# EAGLE design TQFP32ProgrammerShield (EAGLE 8.2.1)
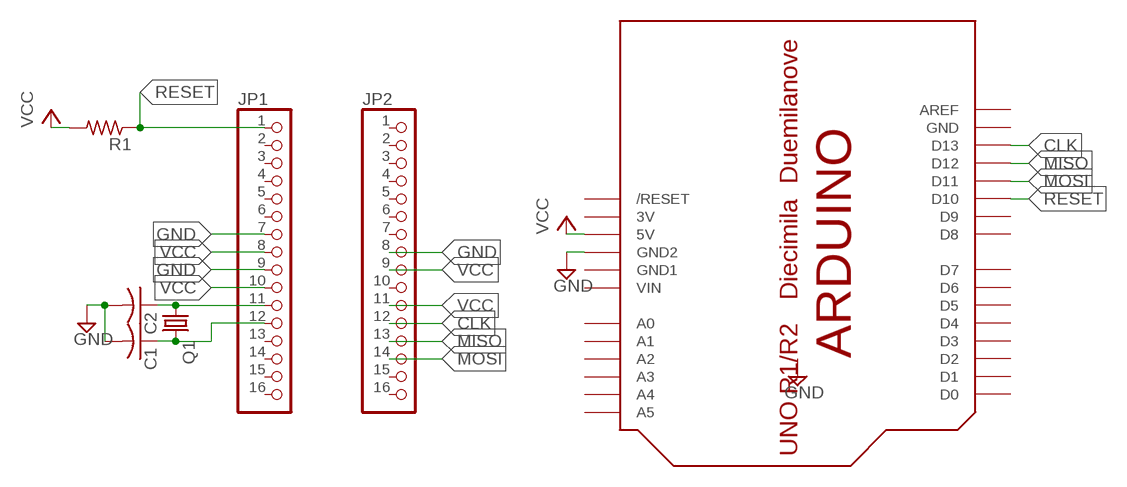
[diagram p0: schematic, sheet 1]

## Parts
C1  C-US025-030X050  [C025-030X050]
C2  C-US025-030X050  [C025-030X050]
JP1  PINHD-1X16  [1X16]
JP2  PINHD-1X16  [1X16]
Q1  CRYSTALHC49S  [HC49/S]
R1  R-US_0204/7  [0204/7]
U$1  ARDUINO-NODIM  [ARDUINO-NODIM]

## Nets
CLK: JP2.12 U$1.D13
CLK2: C1.1 JP1.12 Q1.2
GND: C1.2 C2.2 JP1.7 JP1.9 JP2.8 U$1.GND2
MISO: JP2.13 U$1.D12
MOSI: JP2.14 U$1.D11
N$2: C2.1 JP1.11 Q1.1
RESET: JP1.1 R1.1 U$1.D10
VCC: JP1.8 JP1.10 JP2.9 JP2.11 R1.2 U$1.5V
Unconnected: JP1.2 JP1.3 JP1.4 JP1.5 JP1.6 JP1.13 JP1.14 JP1.15 JP1.16 JP2.1 JP2.2 JP2.3 JP2.4 JP2.5 JP2.6 JP2.7 JP2.10 JP2.15 JP2.16 U$1.A0 U$1.A1 U$1.A2 U$1.A3 U$1.A4 U$1.A5 U$1.AREF U$1.D0 U$1.D1 U$1.D2 U$1.D3 U$1.D4 U$1.D5 U$1.D6 U$1.D7 U$1.D8 U$1.D9 U$1.RESET(/RESET)

## Power pins joined to a net without a drawn wire
3V: U$1.3V
GND: U$1.GND
GND1: U$1.GND1
VIN: U$1.VIN

## Library data of the parts
C1 C2 = adafruit:C-US: CAPACITOR, American symbol
JP1 JP2 = pinhead:PINHD-1X16: PIN HEADER
Q1 = adafruit:CRYSTAL: CRYSTAL; OC_FARNELL: 1667008; OC_NEWARK: unknown
R1 = adafruit:R-US_: RESISTOR, American symbol
U$1 = adafruit:ARDUINO: Arduino Diecimila/Duemilanove Make a shield with ease, this package has all the named pins as well as the two mounting drill holes and an outline of the USB and DC power connector. The outline is on the DIMENSION layer, so if your board house uses it they will cut the outline to match. http://www.ladyada.net/library/pcb/eaglelibrary.html

## Board
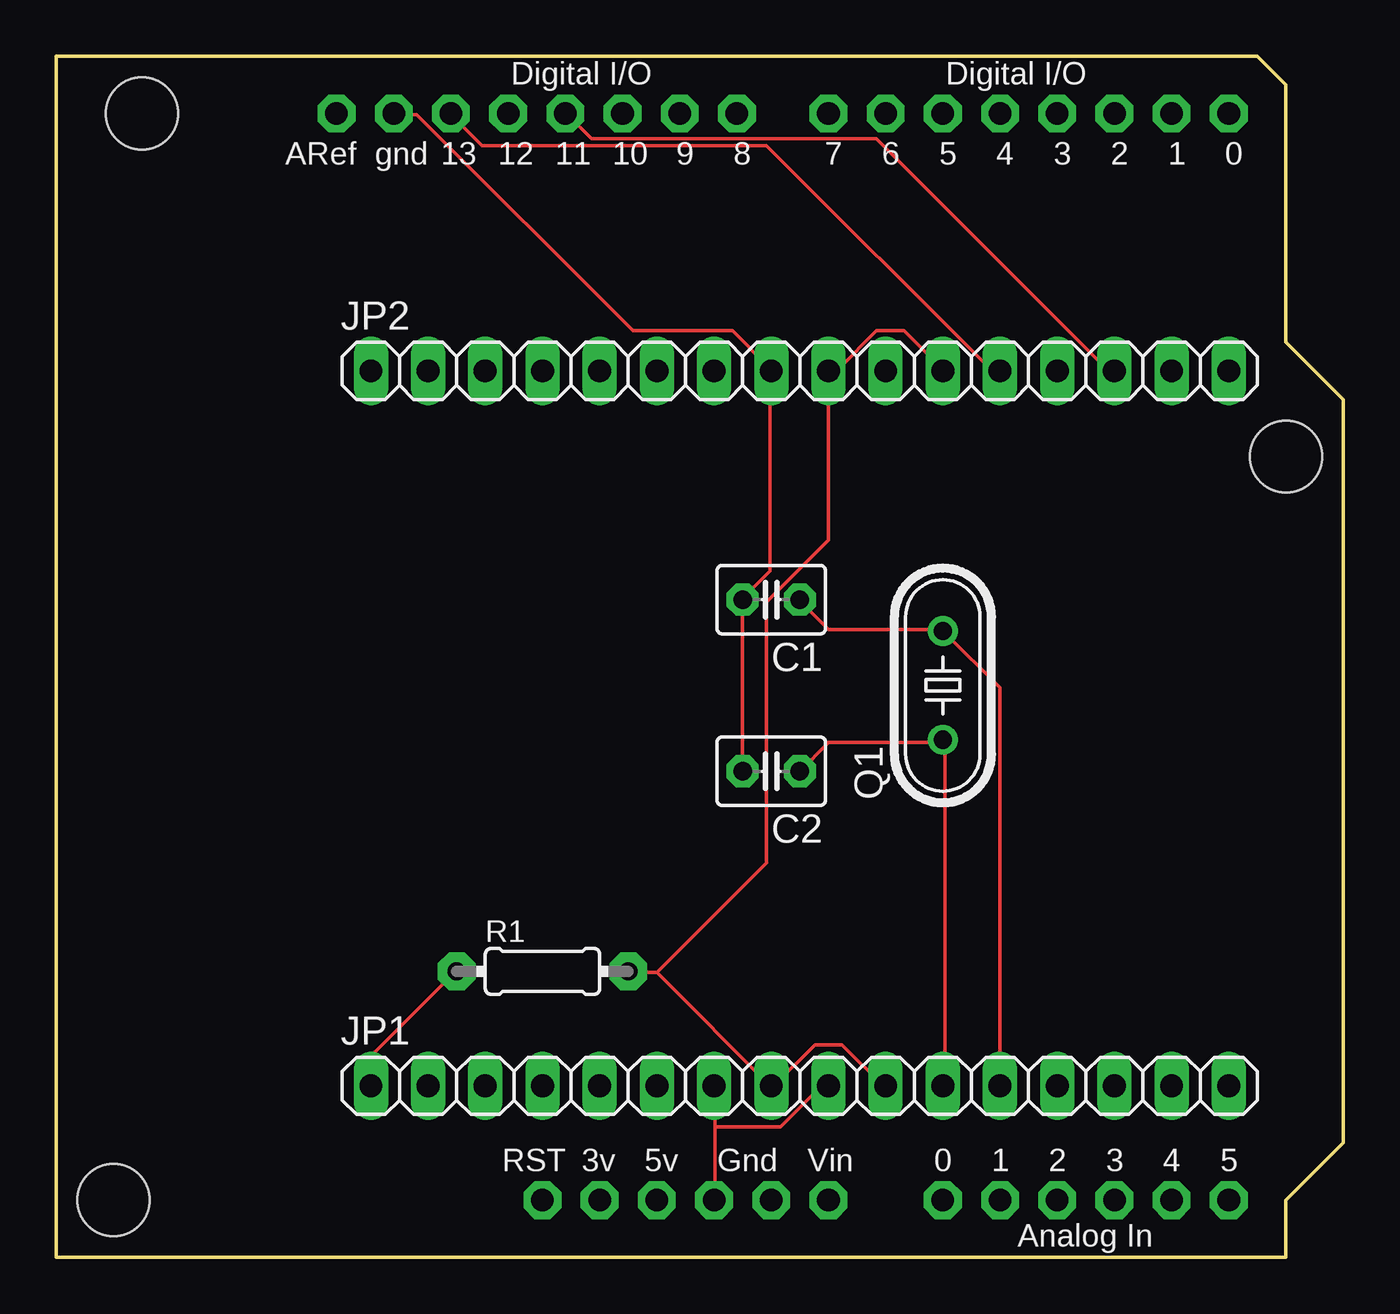
[diagram p1: board, top side]
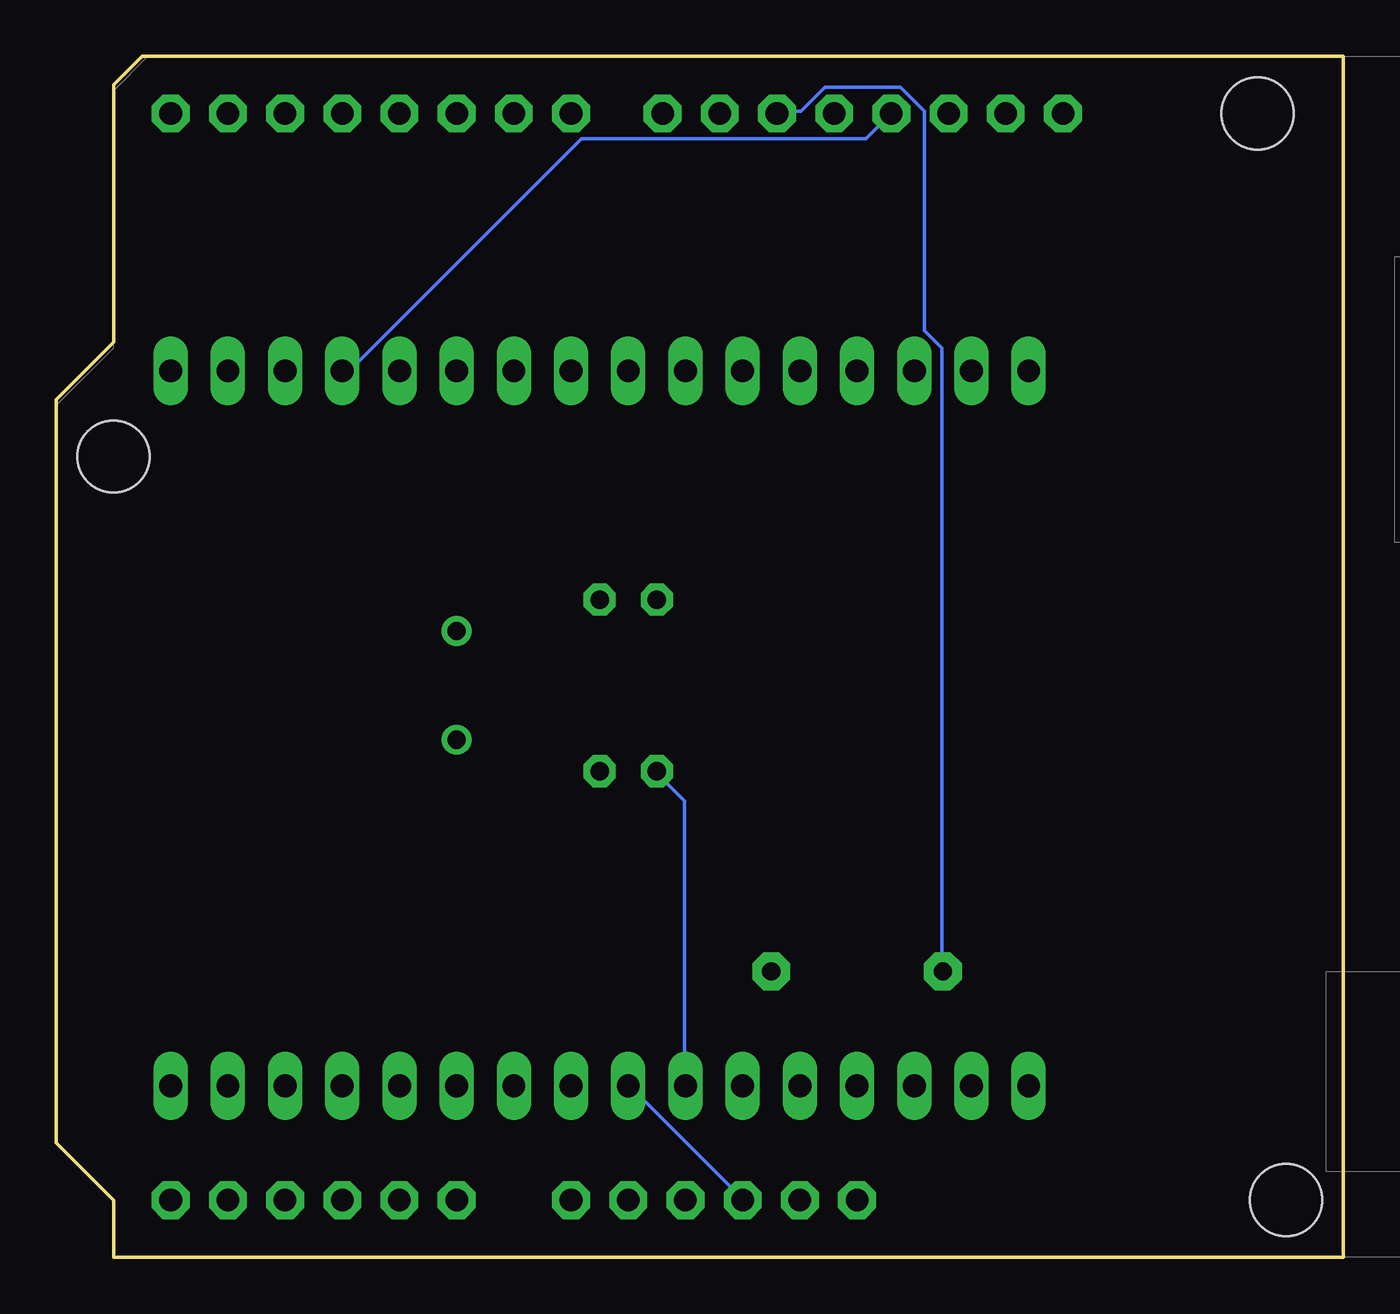
[diagram p2: board, bottom side, seen from below]

Size 57.15 x 53.34 mm. Coordinates in mm from the lower left corner, seen from the top.
Outline: 0,0 0,53.34 53.34,53.34 54.61,52.07 54.61,40.64 57.15,38.1 57.15,5.08 54.61,2.54 54.61,0 0,0
Copper layers (1*16): Top 0.035mm / dielectric 1.5mm / Bottom 0.035mm
Design rules "default": minimum track width 6mil, minimum drill 0.35mm, track to track 6mil, track to pad 6mil, pad to pad 6mil, via to via 6mil, smd to smd 6mil, copper to edge 40mil, drill to drill 6mil, minimum pad ring 10mil, minimum via ring 8mil, stop-mask expansion 4mil, vias tented up to drill 0mil, thermal gap 10mil

### Footprints (pad centres in the part's own frame; a part is rotated, then mirrored left to right if it is on the bottom)
C025-030X050 = drill 0.813 pad 1.422 octagon: 1 -1.27,0; 2 1.27,0
1X16 = drill 1.016 long: 1 -19.05,0; 2 -16.51,0; 3 -13.97,0; 4 -11.43,0; 5 -8.89,0; 6 -6.35,0; 7 -3.81,0; 8 -1.27,0; 9 1.27,0; 10 3.81,0; 11 6.35,0; 12 8.89,0; 13 11.43,0; 14 13.97,0; 15 16.51,0; 16 19.05,0
HC49/S = drill 0.813: 1 -2.413,0; 2 2.413,0
0204/7 = drill 0.813 pad 1.676 octagon: 1 -3.81,0; 2 3.81,0
ARDUINO-NODIM = drill 1 pad 1.676 octagon: 3V 35.56,2.54; 5V 38.1,2.54; A0 50.8,2.54; A1 53.34,2.54; A2 55.88,2.54; A3 58.42,2.54; A4 60.96,2.54; A5 63.5,2.54; AREF 23.876,50.8; D0 63.5,50.8; D1 60.96,50.8; D2 58.42,50.8; D3 55.88,50.8; D4 53.34,50.8; D5 50.8,50.8; D6 48.26,50.8; D7 45.72,50.8; D8 41.656,50.8; D9 39.116,50.8; D10 36.576,50.8; D11 34.036,50.8; D12 31.496,50.8; D13 28.956,50.8; GND 26.416,50.8; GND1 43.18,2.54; GND2 40.64,2.54; RESET 33.02,2.54; VIN 45.72,2.54 | hole 3.2: 15.24,50.8; 66.04,35.56; 13.97,2.54

### Placement (x,y rotation side)
C1  31.75,29.21 180 top
C2  31.75,21.59 180 top
JP1  33.02,7.62 0 top
JP2  33.02,39.37 0 top
Q1  39.37,25.4 90 top
R1  21.59,12.7 0 top
U$1  -11.43,0 0 top

### Tracks (layer width: path | path; a pad name or v marks a point on that pad's centre or on a via)
CLK
  Top 0.152: JP2.12 41.91,39.47 41.45,39.47 31.55,49.38 18.9,49.38 17.53,50.75 U$1.D13
CLK2
  Top 0.152: C1.1 33.07,29.11 34.29,27.89 39.32,27.89 Q1.2 39.47,27.74 41.91,25.3 JP1.12
GND
  Top 0.152: 29.26,5.79 29.26,2.59 U$1.GND2 | 29.26,5.79 29.26,7.62 JP1.7 | JP1.9 33.98,7.62 32.16,5.79 29.26,5.79 | C2.2 C1.2 30.48,29.26 31.7,30.48 31.7,39.32 JP2.8 31.7,39.47 30.02,41.15 25.6,41.15 16,50.75 15.09,50.75 U$1.GND
  Bottom 0.152: JP1.7 29.26,7.62 29.26,20.27 30.48,21.49 C2.2
MISO
  Bottom 0.152: U$1.D12 21.18,49.68 33.83,49.68 44.04,39.47 44.35,39.47 JP2.13
MOSI
  Top 0.152: JP2.14 46.94,39.47 46.63,39.47 36.42,49.68 23.77,49.68 22.71,50.75 U$1.D11
N$2
  Top 0.152: C2.1 34.29,22.86 39.32,22.86 Q1.1 39.47,22.86 39.47,7.62 JP1.11
RESET
  Top 0.152: JP1.1 14.02,7.62 14.02,8.99 17.68,12.65 R1.1
  Bottom 0.152: U$1.D10 25.15,50.9 24.08,50.9 23.01,51.97 19.66,51.97 18.59,50.9 18.59,41.15 17.83,40.39 17.83,12.8 R1.1
VCC
  Top 0.152: JP2.11 39.32,39.47 37.64,41.15 36.42,41.15 34.75,39.47 34.29,39.47 JP2.9 34.29,31.85 31.55,29.11 31.55,17.53 26.67,12.65 | JP1.10 36.73,7.62 34.9,9.45 33.68,9.45 31.85,7.62 JP1.8 31.7,7.62 26.67,12.65 | 26.67,12.65 25.45,12.65 R1.2
  Bottom 0.152: U$1.5V 26.67,2.59 31.7,7.62 JP1.8